# EAGLE design TapuinoNext-Mini (EAGLE 9.6.2)
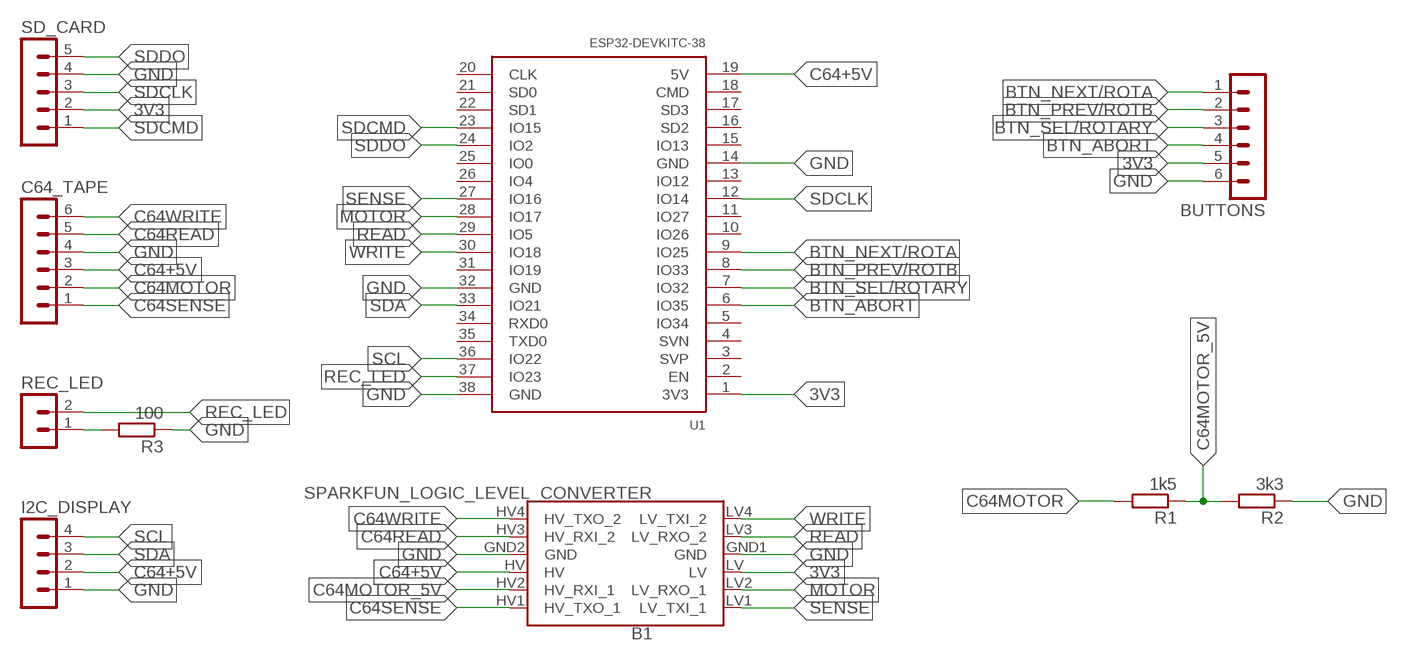
[diagram p0: schematic, sheet 1]

## Parts
B1  SPARKFUN_LOGIC_LEVEL_CONVERTER  [SPARKFUN_LOGIC_LEVEL_CONVERTER]
BUTTONS  MA06-1  [MA06-1]
C64_TAPE  MA06-1  [MA06-1]
I2C_DISPLAY  MA04-1  [MA04-1]
R1  1k5  R-EU_0207/10  [0207/10]
R2  3k3  R-EU_0207/10  [0207/10]
R3  100  R-EU_0207/10  [0207/10]
REC_LED  MA02-1  [MA02-1]
SD_CARD  MA05-1  [MA05-1]
U1  ESP32-DEVKITC-38  [ESP32-DEVKITC-38]

## Nets
3V3: B1.LV BUTTONS.5 SD_CARD.2 U1.1(3V3)
BTN_ABORT: BUTTONS.4 U1.6(IO35)
BTN_NEXT/ROTA: BUTTONS.1 U1.9(IO25)
BTN_PREV/ROTB: BUTTONS.2 U1.8(IO33)
BTN_SEL/ROTARY: BUTTONS.3 U1.7(IO32)
C64+5V: B1.HV C64_TAPE.3 I2C_DISPLAY.2 U1.19(5V)
C64MOTOR: C64_TAPE.2 R1.2
C64MOTOR_5V: B1.HV2(HV_RXI_1) R1.1 R2.2
C64READ: B1.HV3(HV_RXI_2) C64_TAPE.5
C64SENSE: B1.HV1(HV_TXO_1) C64_TAPE.1
C64WRITE: B1.HV4(HV_TXO_2) C64_TAPE.6
GND: B1.GND1(GND) B1.GND2(GND) BUTTONS.6 C64_TAPE.4 I2C_DISPLAY.1 R2.1 R3.1 SD_CARD.4 U1.14(GND) U1.32(GND) U1.38(GND)
MOTOR: B1.LV2(LV_RXO_1) U1.28(IO17)
N$1: R3.2 REC_LED.1
READ: B1.LV3(LV_RXO_2) U1.29(IO5)
REC_LED: REC_LED.2 U1.37(IO23)
SCL: I2C_DISPLAY.4 U1.36(IO22)
SDA: I2C_DISPLAY.3 U1.33(IO21)
SDCLK: SD_CARD.3 U1.12(IO14)
SDCMD: SD_CARD.1 U1.23(IO15)
SDDO: SD_CARD.5 U1.24(IO2)
SENSE: B1.LV1(LV_TXI_1) U1.27(IO16)
WRITE: B1.LV4(LV_TXI_2) U1.30(IO18)
Unconnected: U1.2(EN) U1.3(SVP) U1.4(SVN) U1.5(IO34) U1.10(IO26) U1.11(IO27) U1.13(IO12) U1.15(IO13) U1.16(SD2) U1.17(SD3) U1.18(CMD) U1.20(CLK) U1.21(SD0) U1.22(SD1) U1.25(IO0) U1.26(IO4) U1.31(IO19) U1.34(RXD0) U1.35(TXD0)

## Library data of the parts
B1 = SparkFun-Boards:SPARKFUN_LOGIC_LEVEL_CONVERTER: SparkFun Logic Level Converter -Bi-Directional This is the mechnical outline for the 3.3V - 5V bi directional logic level converter. *Note, the "LOCK" Package has the header pins staggered by an offset of 5 mils (off center line), so that when you slide a row of standard 0.1" headers into the PTH pads, it will hold position vertically. See the follwing turorial for more information on this type of special footprints: Sneaky Footprints <https://www.sparkfun.com/tutorials/114> SparkFun Products: SparkFun Logic Level Converter - Bi-Directional <https://www.sparkfun.com/products/12009>
BUTTONS C64_TAPE = con-lstb:MA06-1: PIN HEADER; OC_FARNELL: unknown; OC_NEWARK: unknown
I2C_DISPLAY = con-lstb:MA04-1: PIN HEADER; OC_FARNELL: unknown; OC_NEWARK: unknown
R1-R3 = rcl:R-EU_: RESISTOR, European symbol; SPICEPREFIX: R
REC_LED = con-lstb-ext:MA02-1: PIN HEADER; OC_FARNELL: unknown; OC_NEWARK: unknown
SD_CARD = con-lstb:MA05-1: PIN HEADER; OC_FARNELL: unknown; OC_NEWARK: unknown
U1 = ESP32-DEVKITC-38PIN:ESP32-DEVKITC-38: General Dev Kit Board For Esp-Wroom-32. This is the wider 38 pin version for which there was no accurate footprint available on the net.; AUTHOR: SWEETLILMRE

## Board
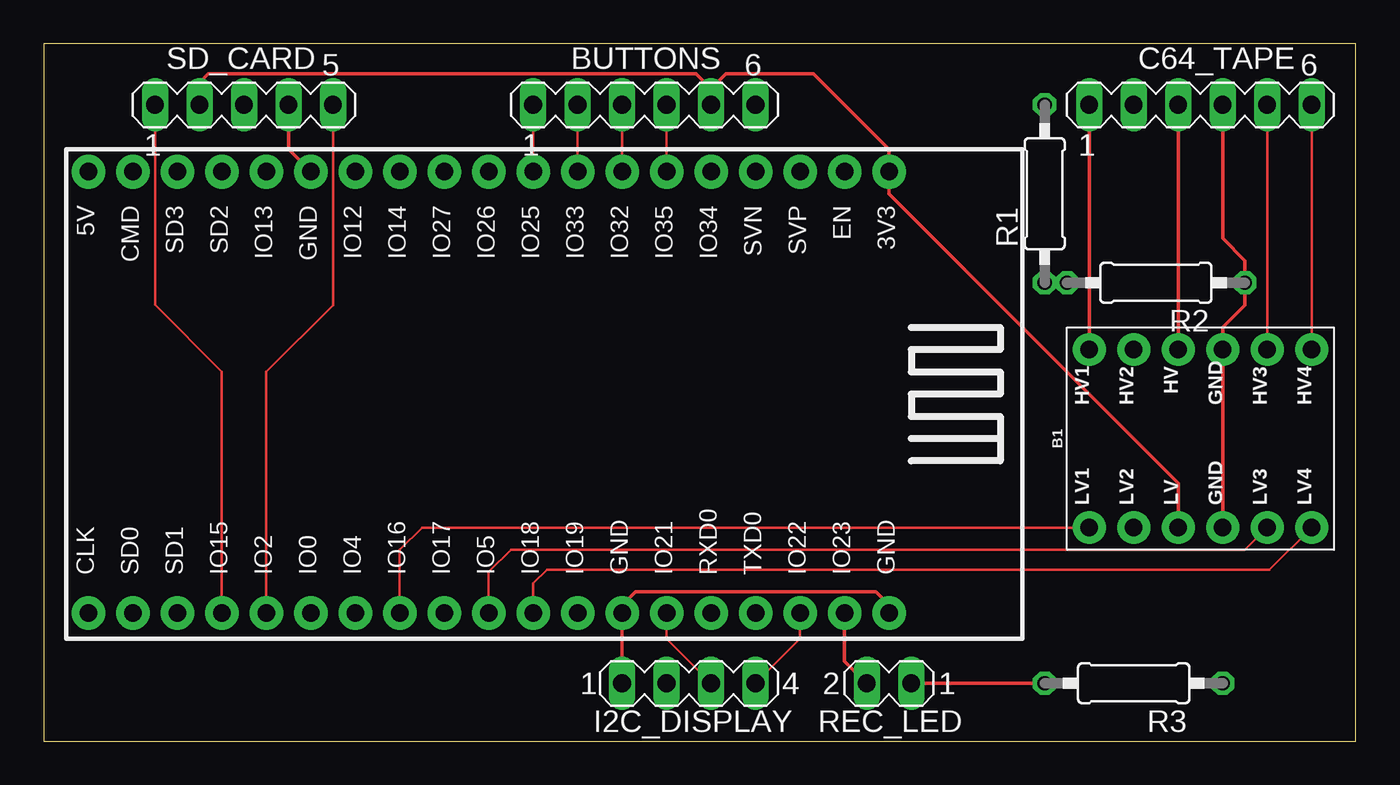
[diagram p1: board, top side]
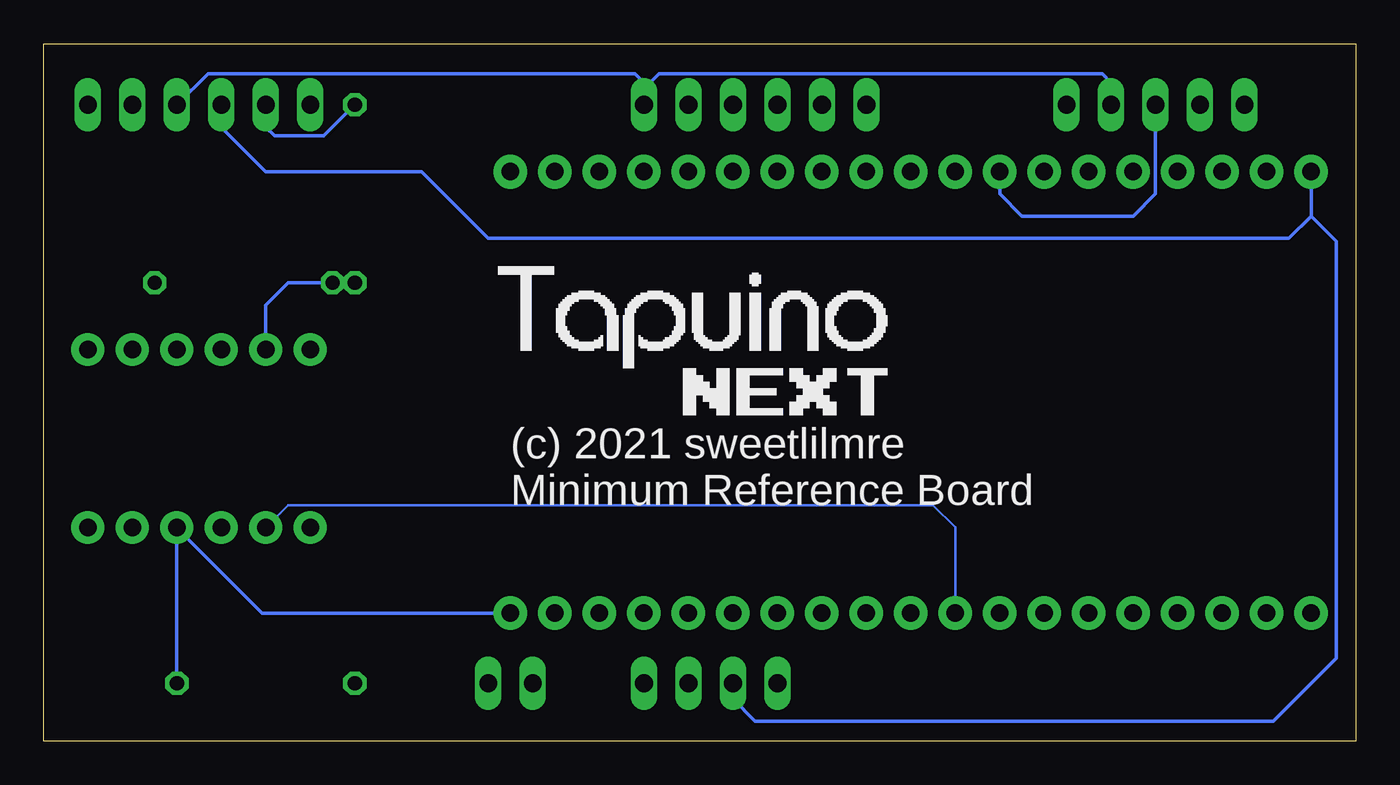
[diagram p2: board, bottom side, seen from below]

Size 74.91 x 39.8 mm. Coordinates in mm from the lower left corner, seen from the top.
Outline: 0,0 74.91,0 74.91,39.8 0,39.8 0,0
Copper layers (1*16): Top 0.035mm / dielectric 1.5mm / Bottom 0.035mm
Design rules "default": minimum track width 6mil, minimum drill 0.35mm, track to track 6mil, track to pad 6mil, pad to pad 6mil, via to via 6mil, smd to smd 6mil, copper to edge 40mil, drill to drill 6mil, minimum pad ring 10mil, minimum via ring 8mil, stop-mask expansion 4mil, vias tented up to drill 0mil, thermal gap 10mil

### Footprints (pad centres in the part's own frame; a part is rotated, then mirrored left to right if it is on the bottom)
SPARKFUN_LOGIC_LEVEL_CONVERTER = drill 1.016 pad 1.88: GND1 -5.08,-1.27; GND2 5.08,-1.27; HV 5.08,1.27; HV1 5.08,6.35; HV2 5.08,3.81; HV3 5.08,-3.81; HV4 5.08,-6.35; LV -5.08,1.27; LV1 -5.08,6.35; LV2 -5.08,3.81; LV3 -5.08,-3.81; LV4 -5.08,-6.35
MA06-1 = drill 1.016 long: 1 -6.35,0; 2 -3.81,0; 3 -1.27,0; 4 1.27,0; 5 3.81,0; 6 6.35,0
MA04-1 = drill 1.016 long: 1 -3.81,0; 2 -1.27,0; 3 1.27,0; 4 3.81,0
0207/10 = drill 0.813 octagon: 1 -5.08,0; 2 5.08,0
MA02-1 = drill 1.016 long: 1 -1.27,0; 2 1.27,0
MA05-1 = drill 1.016 long: 1 -5.08,0; 2 -2.54,0; 3 0,0; 4 2.54,0; 5 5.08,0
ESP32-DEVKITC-38 = drill 1 pad 1.93: 1 12.69,-20.33; 2 12.69,-17.79; 3 12.69,-15.25; 4 12.69,-12.71; 5 12.69,-10.17; 6 12.69,-7.63; 7 12.69,-5.09; 8 12.69,-2.55; 9 12.69,-0.01; 10 12.69,2.53; 11 12.69,5.07; 12 12.69,7.61; 13 12.69,10.15; 14 12.69,12.69; 15 12.69,15.23; 16 12.69,17.77; 17 12.69,20.31; 18 12.69,22.85; 19 12.69,25.39; 20 -12.5,25.39; 21 -12.5,22.85; 22 -12.5,20.31; 23 -12.5,17.77; 24 -12.5,15.23; 25 -12.5,12.69; 26 -12.5,10.15; 27 -12.5,7.61; 28 -12.5,5.07; 29 -12.5,2.53; 30 -12.5,-0.01; 31 -12.5,-2.55; 32 -12.5,-5.09; 33 -12.5,-7.63; 34 -12.5,-10.17; 35 -12.5,-12.71; 36 -12.5,-15.25; 37 -12.5,-17.79; 38 -12.5,-20.33

### Placement (x,y rotation side)
B1  66.04,17.27 90 top
BUTTONS  34.29,36.32 0 top
C64_TAPE  66.04,36.32 0 top
I2C_DISPLAY  36.83,3.3 0 top
R1  57.15,31.24 90 top
R2  63.5,26.16 180 top
R3  62.23,3.3 180 top
REC_LED  48.26,3.3 180 top
SD_CARD  11.43,36.32 0 top
U1  27.94,19.81 90 top

### Tracks (layer width: path | path; a pad name or v marks a point on that pad's centre or on a via)
3V3
  Top 0.203: BUTTONS.5 38.1,37.25 | 38.1,37.25 37.25,38.1 9.4,38.1 8.89,37.59 SD_CARD.2 | 38.1,37.25 38.95,38.1 43.94,38.1 48.27,33.77 U1.1 48.27,31.23 64.77,14.73 B1.LV
BTN_ABORT
  Top 0.152: BUTTONS.4 U1.6
BTN_NEXT/ROTA
  Top 0.152: BUTTONS.1 U1.9
BTN_PREV/ROTB
  Top 0.152: BUTTONS.2 U1.8
  Bottom 0.152: BUTTONS.2
BTN_SEL/ROTARY
  Top 0.152: BUTTONS.3 U1.7
  Bottom 0.152: BUTTONS.3
C64+5V
  Top 0.203: B1.HV C64_TAPE.3
  Bottom 0.203: C64_TAPE.3 64.77,35.05 62.23,32.51 53.34,32.51 49.53,28.7 3.82,28.7 2.55,29.97 U1.19 2.55,29.96 1.12,28.53 1.12,4.72 4.7,1.14 34.29,1.14 35.56,2.41 I2C_DISPLAY.2
C64MOTOR
  Bottom 0.203: R1.2 58.93,34.54 61.72,34.54 62.23,35.05 C64_TAPE.2
C64MOTOR_5V
  Bottom 0.203: B1.HV2 62.23,24.89 60.96,26.16 R2.2 R1.1
C64READ
  Top 0.152: C64_TAPE.5 B1.HV3
C64SENSE
  Top 0.203: B1.HV1 C64_TAPE.1
C64WRITE
  Top 0.152: C64_TAPE.6 B1.HV4
GND
  Top 0.152: U1.32
  Top 0.203: B1.GND1 B1.GND2 67.31,23.62 68.58,24.89 R2.1 68.58,27.43 67.31,28.7 C64_TAPE.4 | U1.38 48.27,7.77 47.51,8.53 33.8,8.53 33.03,7.77 U1.32 I2C_DISPLAY.1 | SD_CARD.4 13.97,33.78 U1.14
  Bottom 0.203: C64_TAPE.4 65.53,38.1 41.15,38.1 40.64,37.59 BUTTONS.6 40.64,37.25 39.79,38.1 14.48,38.1 13.97,37.59 SD_CARD.4 | U1.38 62.43,7.31 B1.GND1 R3.1
MOTOR
  Bottom 0.152: U1.28 22.87,12.2 24.13,13.46 60.96,13.46 B1.LV2
N$1
  Top 0.203: REC_LED.1 R3.2
READ
  Top 0.152: B1.LV3 68.58,10.92 26.67,10.92 25.41,9.66 U1.29
REC_LED
  Top 0.203: U1.37 45.73,4.57 45.73,4.56 REC_LED.2
SCL
  Top 0.152: U1.36 43.19,5.85 I2C_DISPLAY.4
SDA
  Top 0.152: U1.33 35.57,5.83 I2C_DISPLAY.3
SDCLK
  Bottom 0.203: SD_CARD.3 11.43,31.24 12.7,29.97 19.05,29.97 20.33,31.25 U1.12
SDCMD
  Top 0.152: U1.23 10.17,21.08 6.35,24.9 SD_CARD.1
SDDO
  Top 0.152: U1.24 12.71,21.08 16.51,24.88 SD_CARD.5
SENSE
  Top 0.152: B1.LV1 21.59,12.19 20.33,10.93 U1.27
WRITE
  Top 0.152: B1.LV4 69.97,9.78 28.73,9.78 27.95,9 U1.30

### Text on the board
bPlace: (c) 2021 sweetlilmre / Minimum Reference Board